# EAGLE design STM32G0_Breakout_Board (EAGLE 9.4.2)
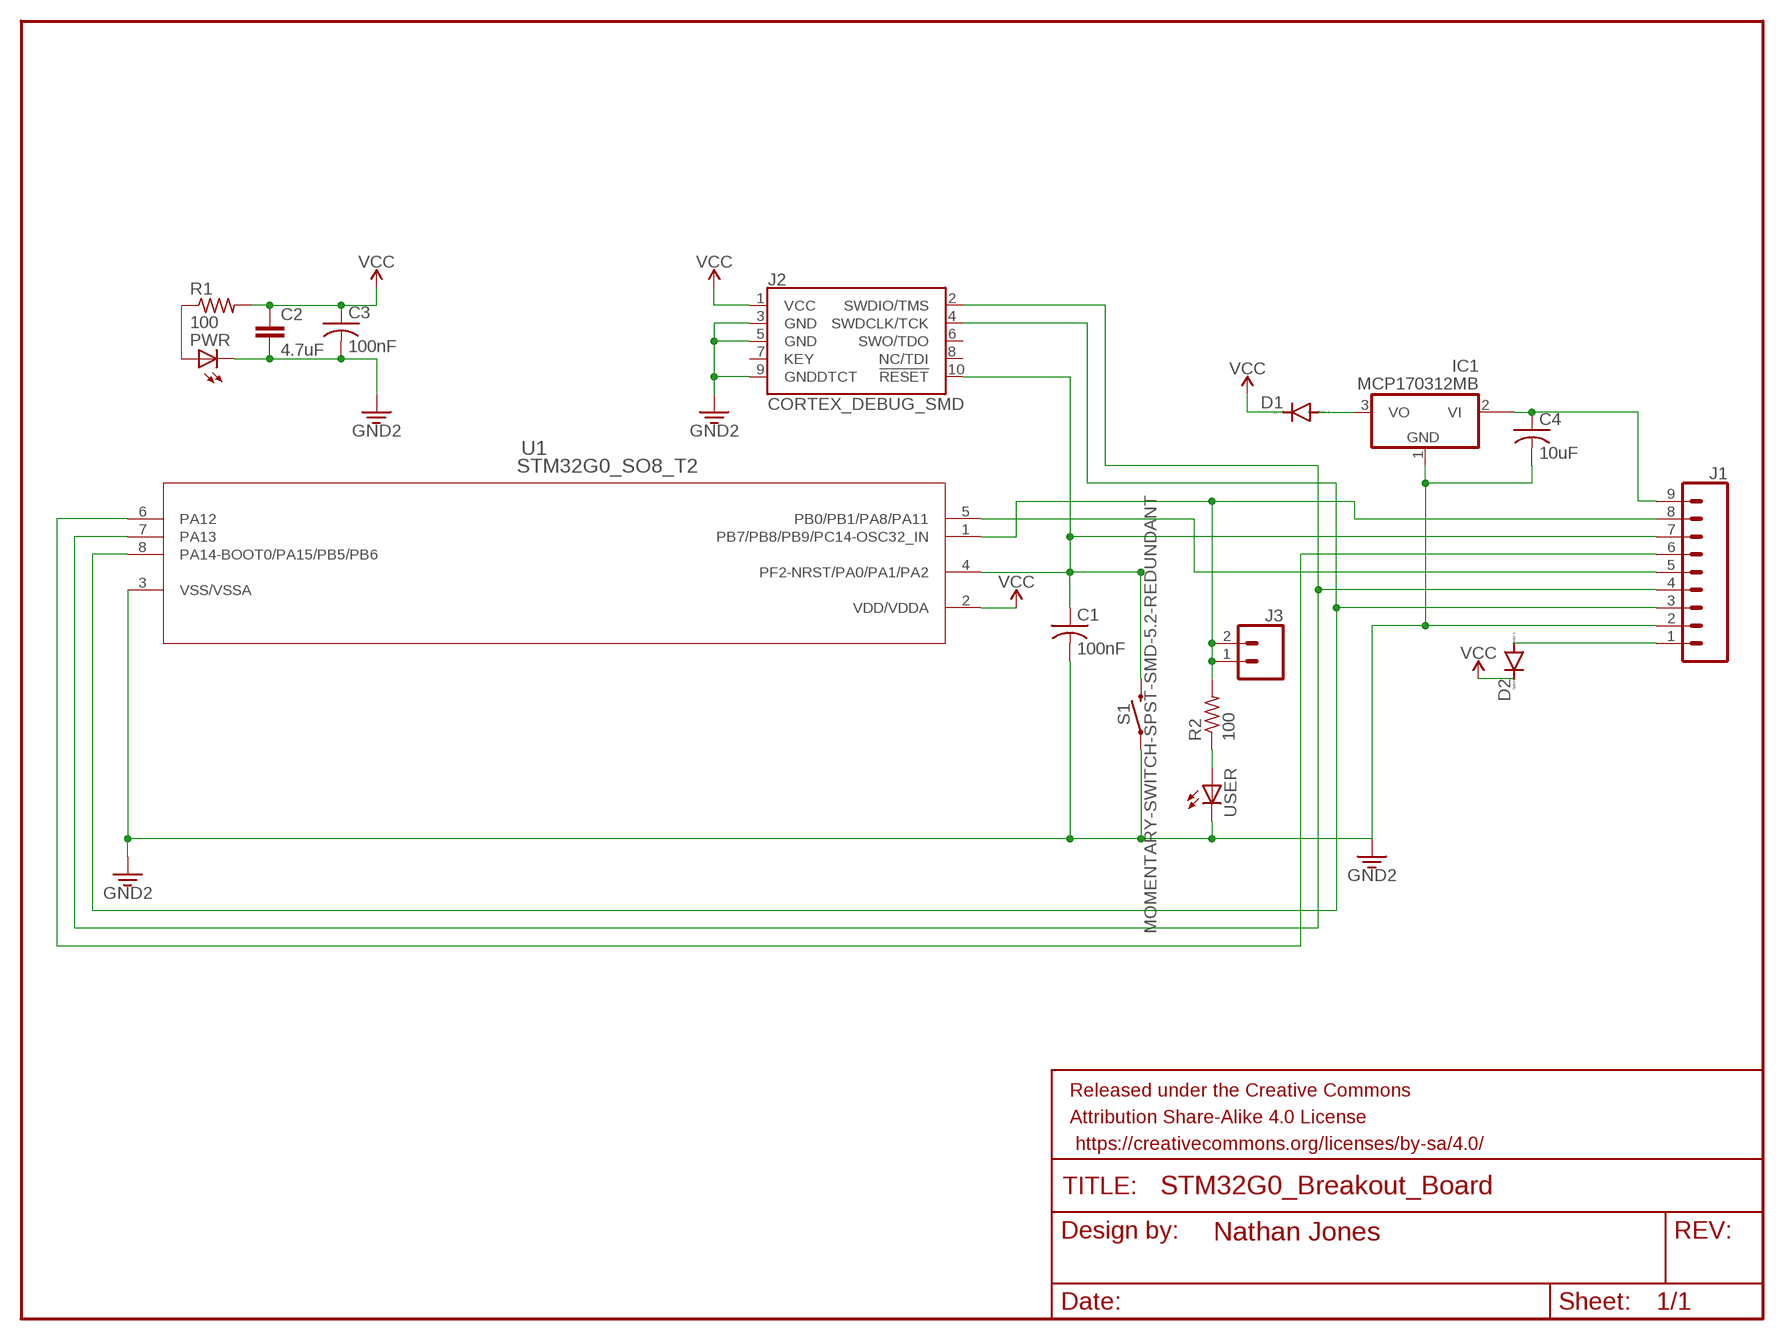
[diagram p0: schematic, sheet 1]

## Parts
C1  100nF  C-USC1206  [C1206]
C2  4.7uF  4.7UF-1206-16V-(+80/-20%)  [1206]
C3  100nF  C-USC1206  [C1206]
C4  10uF  C-USC1206  [C1206]
D1  DIODE-DO-214AC  [DO-214AC]
D2  DIODE-DO-214AC  [DO-214AC]
FRAME1  FRAME-LETTERNO_PACKAGE  [DUMMY]
IC1  MCP170312MB  [SOT89]
J1  CONN_09LONGPADS  [1X09_LONGPADS]
J2  CORTEX_DEBUG_SMD  [SAMTECH_FTSH-105-01]
J3  CONN_02PTH3  [1X02_LONGPADS]
PWR  LEDCHIP-LED0805  [CHIP-LED0805]
R1  100  R-US_R1206  [R1206]
R2  100  R-US_R1206  [R1206]
S1  MOMENTARY-SWITCH-SPST-SMD-5.2-REDUNDANT  [TACTILE_SWITCH_SMD_5.2MM]
U1  STM32G0_SO8_T2  [SO-8]
USER  LEDCHIP-LED0805  [CHIP-LED0805]

## Nets
GND: C1.2 C2.2 C3.2 C4.2 IC1.1(GND) J1.2 J2.3(GND) J2.5(GND) J2.9(GNDDTCT) PWR.C S1.1 S1.2 U1.3(VSS/VSSA) USER.C ; supply symbol labelled GND2
N$1: R2.1 USER.A
N$2: D2.A J1.1
N$3: C4.1 IC1.2@1(VI1) J1.9
N$4: PWR.A R1.1
N$5: D1.A IC1.3(VO)
NRST/PA0/PA1/PA2: C1.1 J1.7 J2.10(!RESET) S1.3 S1.4 U1.4(PF2-NRST/PA0/PA1/PA2)
PA12: J1.6 U1.6(PA12)
PB0/PB1/PA8/PA11: J1.5 U1.5(PB0/PB1/PA8/PA11)
PC14: J1.8 J3.1 J3.2 R2.2 U1.1(PB7/PB8/PB9/PC14-OSC32_IN)
SWDCLK: J1.3 J2.4(SWDCLK/TCK) U1.8(PA14-BOOT0/PA15/PB5/PB6)
SWDIO: J1.4 J2.2(SWDIO/TMS) U1.7(PA13)
VCC: C2.1 C3.1 D1.C D2.C J2.1(VCC) R1.2 U1.2(VDD/VDDA)
Unconnected: IC1.2(VI) J2.6(SWO/TDO) J2.7(KEY) J2.8(NC/TDI)

## Library data of the parts
C1 C3 C4 = adafruit:C-US: CAPACITOR, American symbol
C2 = SparkFun-Capacitors:4.7UF: 4.7µF ceramic capacitors A capacitor is a passive two-terminal electrical component used to store electrical energy temporarily in an electric field.; PROD_ID: CAP-10300
D1 D2 = diode:DIODE-: DIODE
FRAME1 = SparkFun-Aesthetics:FRAME-LETTER: Schematic Frame - Letter Standard 8.5x11 US Letter frame; DESIGNER: Nathan Jones; VERSION: v01
IC1 = linear:MCP1703*: 250 mA, 16V, Low Quiescent Current LDO Regulator Source: http://ww1.microchip.com/downloads/en/DeviceDoc/22049b.pdf
J1 = SparkFun-Connectors:CONN_09: Multi connection point. Often used as Generic Header-pin footprint for 0.1 inch spaced/style header connections On any of the 0.1 inch spaced packages, you can populate with these: Break Away Headers - Straight <https://www.sparkfun.com/products/116> (PRT-00116) Break Away Male Headers - Right Angle <https://www.sparkfun.com/products/553> (PRT-00553) Female Headers <https://www.sparkfun.com/products/115> (PRT-00115) Break Away Headers - Machine Pin <https://www.sparkfun.com/products/117> (PRT-00117) Break Away Female Headers - Swiss Machine Pin <https://www.sparkfun.com/products/743> (PRT-00743) For SCREWTERMINALS and SPRING TERMINALS visit here: Screw Terimnals on SparkFun.com <https://www.sparkfun.com/search/results?term=Screw+Terminals> (5mm/3.5mm/2.54mm spacing) This device is also useful as a general connection point to wire up your design to another part of your project. Our various solder wires solder well into these plated through hole pads. Hook-Up Wire - Assortment (Stranded, 22 AWG) <https://www.sparkfun.com/products/11375> (PRT-11375) Hook-Up Wire - Assortment (Solid Core, 22 AWG) <https://www.sparkfun.com/products/11367> (PRT-11367) View the entire wire category on our website here <https://www.sparkfun.com/categories/141> Special notes: Molex polarized connector foot print use with SKU : PRT-08231 with associated crimp pins and housings. 1MM SMD Version SKU: PRT-10208 NOTES ON THE VARIANTS LOCK and LOCK_LONGPADS... This footprint was designed to help hold the alignment of a through-hole component (i.e. 6-pin header) while soldering it into place. You may notice that each hole has been shifted either up or down by 0.005 of an inch from it's more standard position (which is a perfectly straight line). This slight alteration caused the pins (the squares in the middle) to touch the edges of the holes. Because they are alternating, it causes a "brace" to hold the component in place. 0.005 has proven to be the perfect amount of "off-center" position when using our standard breakaway headers. Although looks a little odd when you look at the bare footprint, once you have a header in there, the alteration is very hard to notice. Also,if you push a header all the way into place, it is covered up entirely on the bottom side.
J2 = SparkFun-Connectors:CORTEX_DEBUG: Cortex Debug Connector - 10 pin Supports JTAG debug, Serial Wire debug, and Serial Wire Viewer. PTH and SMD connector options available. General Connector Information <http://infocenter.arm.com/help/topic/com.arm.doc.faqs/attached/13634/cortex_debug_connectors.pdf> Products: PTH Connector <http://www.digikey.com/product-detail/en/cnc-tech/3220-10-0100-00/1175-1627-ND/3883661> -via Digi-Key SparkFun PSoc <https://www.sparkfun.com/products/13229> SparkFun T <https://www.sparkfun.com/products/13810>
J3 = SparkFun-Connectors:CONN_02: Multi connection point. Often used as Generic Header-pin footprint for 0.1 inch spaced/style header connections On any of the 0.1 inch spaced packages, you can populate with these: Break Away Headers - Straight <https://www.sparkfun.com/products/116> (PRT-00116) Break Away Male Headers - Right Angle <https://www.sparkfun.com/products/553> (PRT-00553) Female Headers <https://www.sparkfun.com/products/115> (PRT-00115) Break Away Headers - Machine Pin <https://www.sparkfun.com/products/117> (PRT-00117) Break Away Female Headers - Swiss Machine Pin <https://www.sparkfun.com/products/743> (PRT-00743) For SCREWTERMINALS and SPRING TERMINALS visit here: Screw Terimnals on SparkFun.com <https://www.sparkfun.com/search/results?term=Screw+Terminals> (5mm/3.5mm/2.54mm spacing) This device is also useful as a general connection point to wire up your design to another part of your project. Our various solder wires solder well into these plated through hole pads. Hook-Up Wire - Assortment (Stranded, 22 AWG) <https://www.sparkfun.com/products/11375> (PRT-11375) Hook-Up Wire - Assortment (Solid Core, 22 AWG) <https://www.sparkfun.com/products/11367> (PRT-11367) View the entire wire category on our website here <https://www.sparkfun.com/categories/141> Special notes: Molex polarized connector foot print use with: PRT-08233 with associated crimp pins and housings. 2.54_SCREWTERM for use with PRT-10571. 3.5mm Screw Terminal footprints for PRT-08084 5mm Screw Terminal footprints for use with PRT-08432
PWR USER = adafruit:LED: LED OSRAM: - CHIPLED LG R971, LG N971, LY N971, LG Q971, LY Q971, LO R971, LY R971 LH N974, LH R974 LS Q976, LO Q976, LY Q976 LO Q996 - Hyper CHIPLED LW Q18S LB Q993, LB Q99A, LB R99A - SideLED LS A670, LO A670, LY A670, LG A670, LP A670 LB A673, LV A673, LT A673, LW A673 LH A674 LY A675 LS A676, LA A676, LO A676, LY A676, LW A676 LS A679, LY A679, LG A679 - Hyper Micro SIDELED® LS Y876, LA Y876, LO Y876, LY Y876 LT Y87S - SmartLED LW L88C, LW L88S LB L89C, LB L89S, LG L890 LS L89K, LO L89K, LY L89K LS L896, LA L896, LO L896, LY L896 - TOPLED LS T670, LO T670, LY T670, LG T670, LP T670 LSG T670, LSP T670, LSY T670, LOP T670, LYG T670 LG T671, LOG T671, LSG T671 LB T673, LV T673, LT T673, LW T673 LH T674 LS T676, LA T676, LO T676, LY T676, LB T676, LH T676, LSB T676, LW T676 LB T67C, LV T67C, LT T67C, LS T67K, LO T67K, LY T67K, LW E67C LS E67B, LA E67B, LO E67B, LY E67B, LB E67C, LV E67C, LT E67C LW T67C LS T679, LY T679, LG T679 LS T770, LO T770, LY T770, LG T770, LP T770 LB T773, LV T773, LT T773, LW T773 LH T774 LS E675, LA E675, LY E675, LS T675 LS T776, LA T776, LO T776, LY T776, LB T776 LHGB T686 LT T68C, LB T68C - Hyper Mini TOPLED® LB M676 - Mini TOPLED Santana® LG M470 LS M47K, LO M47K, LY M47K Source: http://www.osram.convergy.de/
R1 R2 = rcl:R-US_: RESISTOR, American symbol; SPICEPREFIX: R
S1 = SparkFun-Switches:MOMENTARY-SWITCH-SPST: Momentary Switch (Pushbutton) - SPST Normally-open (NO) SPST momentary switches (buttons, pushbuttons). Variants PTH-12MM - 12mm square, through-hole Momentary Pushbutton Switch - 12mm Square <https://www.sparkfun.com/products/9190> (COM-09190) PTH-6.0MM, PTH-6.0MM-KIT - 6.0mm square, through-hole Mini Pushbutton Switch <https://www.sparkfun.com/products/97> (COM-00097) KIT package intended for soldering kit's - only one side of pads' copper is exposed. PTH-RIGHT-ANGLE-KIT - Right-angle, through-hole Right Angle Tactile Button <https://www.sparkfun.com/products/10791> - Used on SparkFun BigTime Watch Kit <https://www.sparkfun.com/products/11734> SMD-12MM - 12mm square, surface-mount Tactile Button - SMD (12mm) <https://www.sparkfun.com/products/12993> (COM-12993) Used on SparkFun PicoBoard <https://www.sparkfun.com/products/11888> SMD-4.5MM - 4.5mm Square Trackball Switch Used on SparkFun Blackberry Trackballer Breakout <https://www.sparkfun.com/products/13169> SMD-4.6MMX2.8MM - 4.60mm x 2.80mm, surface mount Used on SparkFun SAMD21 Mini Breakout <https://www.sparkfun.com/products/13664> SMD-5.2MM, SMD-5.2-REDUNDANT - 5.2mm square, surface-mount Mini Pushbutton Switch - SMD <https://www.sparkfun.com/products/8720> (COM-08720) Used on Arduino Pro Mini <https://www.sparkfun.com/products/11114> REDUNDANT package connects both switch circuits together SMD-6.0X3.5MM - 6.0 x 3.5mm, surface mount Momentary Reset Switch SMD <https://www.sparkfun.com/products/8229> (COM-08229) SMD-6.2MM-TALL - 6.2mm square, surface mount Tactile Button - SMD (6mm) <https://www.sparkfun.com/products/12992> Used on SparkFun Digital Sandbox <https://www.sparkfun.com/products/12651> SMD-RIGHT-ANGLE - Right-angle, surface mount Used on SparkFun Block for Intel® Edison - Arduino <https://www.sparkfun.com/products/13036>; PROD_ID: SWCH-08247; SF_SKU: COM-08720
U1 = STM32G0:STM32G0_SO8_T2; MANUFACTURER_PART_NUMBER: STM32G0_SO8_T2; VENDOR: STMicroelectronics

## Board
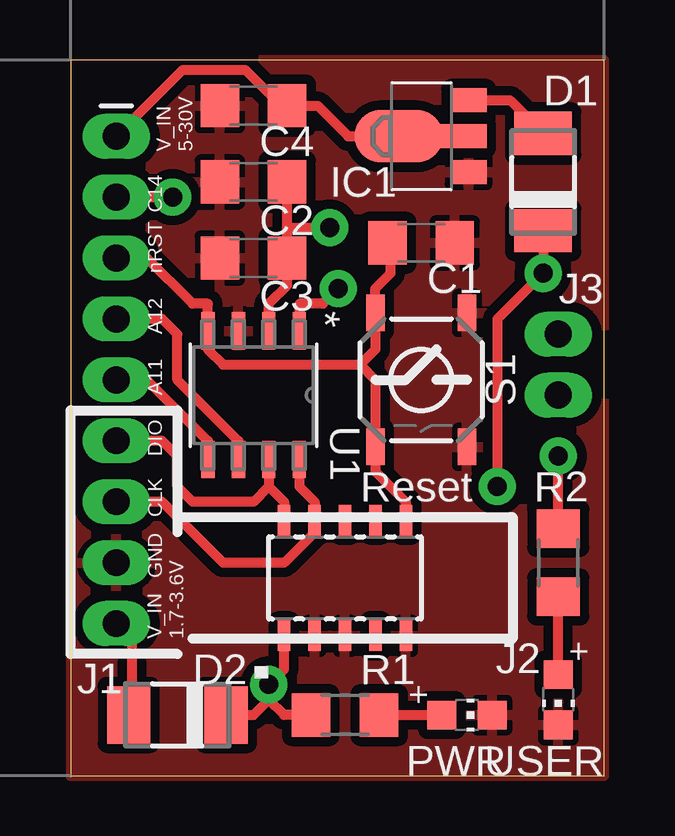
[diagram p1: board, top side]
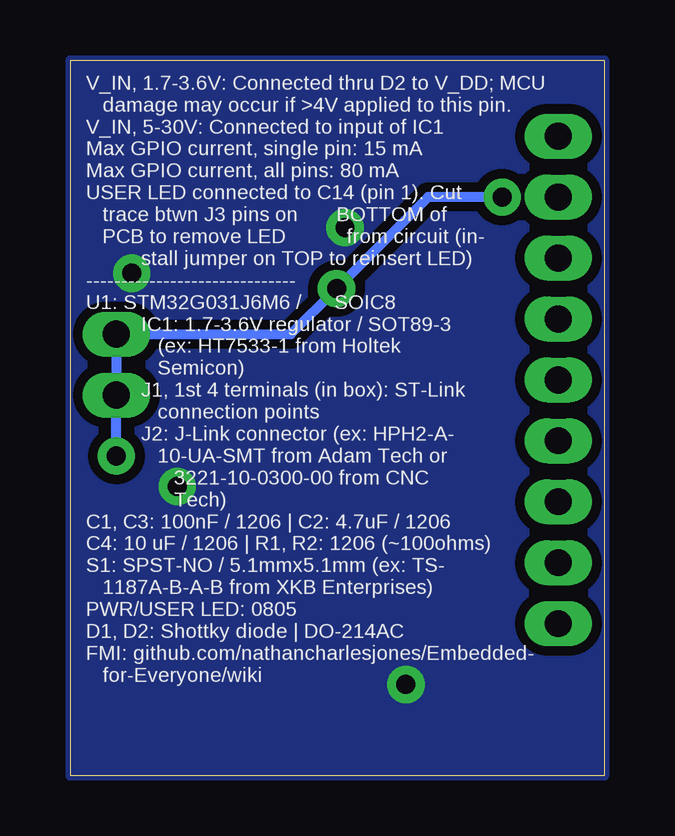
[diagram p2: board, bottom side, seen from below]

Size 22.23 x 29.84 mm. Coordinates in mm from the lower left corner, seen from the top.
Outline: 0,0 22.23,0 22.23,29.84 0,29.84 0,0
Copper layers (1*16): Top 0.035mm / dielectric 1.5mm / Bottom 0.035mm
Design rules "OthermillDRC_1_64_v2": minimum track width 16mil, minimum drill 31mil, track to track 0.39878125mm, track to pad 0.39878125mm, pad to pad 0.39878125mm, via to via 0.39878125mm, smd to smd 0mil, copper to edge 0mil, drill to drill 1mil, minimum pad ring 0mil, minimum via ring 15mil, stop-mask expansion 1mil, vias tented up to drill 30mil, thermal gap 10mil
tKeepout: area 18.4,14.6 to 22.2,19.7
bKeepout: area 0,5.1 to 3.8,27.9

### Footprints (pad centres in the part's own frame; a part is rotated, then mirrored left to right if it is on the bottom)
C1206 = smd 1.6 x 1.8: 1 -1.4,0; 2 1.4,0
1206 = smd 1.6 x 1.8: 1 -1.4,0; 2 1.4,0
DO-214AC = smd 1.8 x 2.4: A 2.025,0; C -2.025,0
SOT89 = smd 1 x 1.5: 1 -1.499,-1.981; 3 1.499,-1.981 | smd 1 x 2: 2 0,-1.727 | smd 2.2 x 3.7: 2@1 0,0.94
1X09_LONGPADS = drill 1.118 pad 1.88 long: 1 0,0; 2 2.54,0; 3 5.08,0; 4 7.62,0; 5 10.16,0; 6 12.7,0; 7 15.24,0; 8 17.78,0; 9 20.32,0
SAMTECH_FTSH-105-01 = smd 0.508 x 1.27: 1 -2.54,-2.413; 2 -2.54,2.413; 3 -1.27,-2.413; 4 -1.27,2.413; 5 0,-2.413; 6 0,2.413; 7 1.27,-2.413; 8 1.27,2.413; 9 2.54,-2.413; 10 2.54,2.413
1X02_LONGPADS = drill 1.118 pad 1.88 long: 1 0,0; 2 2.54,0
CHIP-LED0805 = smd 1.2 x 1.2: A 0,-1.05; C 0,1.05
R1206 = smd 1.6 x 1.803: 1 -1.422,0; 2 1.422,0
TACTILE_SWITCH_SMD_5.2MM = smd 1.524 x 0.762: 1 -2.794,1.905; 2 2.794,1.905; 3 -2.794,-1.905; 4 2.794,-1.905
SO-8 = smd 1.549 x 0.559: 1 -2.68,1.905; 2 -2.68,0.635; 3 -2.68,-0.635; 4 -2.68,-1.905; 5 2.68,-1.905; 6 2.68,-0.635; 7 2.68,0.635; 8 2.68,1.905

### Placement (x,y rotation side)
C1  14.61,22.23 0 top
C2  7.62,24.77 180 top
C3  7.62,21.59 180 top
C4  7.62,27.94 180 top
D1  19.68,24.77 90 top
D2  4.45,2.54 180 top
FRAME1  0,6.35 0 top
IC1  14.61,26.67 90 top
J1  1.91,6.35 90 top
J2  11.43,8.26 0 top
J3  20.32,15.88 90 top
PWR  16.51,2.54 270 top
R1  11.43,2.54 180 top
R2  20.32,8.89 90 top
S1  14.61,16.51 270 top
U1  7.62,15.88 270 top
USER  20.32,3.17 180 top

### Tracks (layer width: path | path; a pad name or v marks a point on that pad's centre or on a via)
GND
  pour Top: 0,0 22.23,0 22.23,29.84 0,29.84
N$1
  Top 0.406: USER.A R2.1
N$2
  Top 0.406: J1.1 2.54,5.71 2.54,2.66 D2.A
N$3
  Top 0.406: J1.9 4.68,29.44 7.27,29.44 8.77,27.94 C4.1 10.29,27.94 11.56,26.67 IC1.2@1
N$4
  Top 0.406: R1.1 PWR.A
N$5
  Top 0.406: IC1.3 18.31,28.17 D1.A
NRST/PA0/PA1/PA2
  Top 0.406: J1.7 3.17,21.59 5.08,19.68 5.71,19.68 U1.4 5.71,17.78 6.35,17.14 12.06,17.14 | 12.06,17.14 12.7,16.51 S1.4 12.7,12.7 13.97,11.43 J2.10 | 12.06,17.14 12.7,17.78 S1.3 12.7,20.32 13.34,20.95 13.34,22.09 C1.1
PA12
  Top 0.406: U1.6 6.99,13.97 4.45,16.51 4.45,18.41 3.81,19.05 J1.6
PB0/PB1/PA8/PA11
  Top 0.406: U1.5 5.71,13.97 3.17,16.51 J1.5
PC14  (via drill 0.79)
  Top 0.406: R2.2 v20.32,13.34 | v11.15,20.32 10.51,19.68 9.53,19.68 U1.1 | J1.8 v4.25,24.13
  Bottom 0.406: v20.32,13.34 J3.1 J3.2 13.05,18.41 v11.15,20.32 7.34,24.13 v4.25,24.13
SWDCLK
  Top 0.406: U1.8 9.53,12.06 10.16,11.43 J2.4 10.16,10.16 8.89,8.89 6.35,8.89 3.81,11.43 J1.3
SWDIO
  Top 0.406: U1.7 8.26,12.06 | 8.26,12.06 8.89,11.43 J2.2 | 8.26,12.06 7.62,11.43 5.08,11.43 4.45,12.06 4.45,13.34 3.81,13.97 J1.4
VCC  (via drill 0.79)
  Top 0.406: D2.C 7.62,2.54 8.26,3.17 | 8.26,3.17 v8.26,3.81 8.89,4.45 J2.1 | R1.2 8.89,2.54 8.26,3.17 | D1.C v19.68,20.95 17.78,19.05 v17.78,12.06 | U1.2 8.26,19.68 9.02,20.45 C3.1 9.02,22.86 | 9.02,22.86 C2.1 | 9.02,22.86 v10.79,22.86
  pour Bottom: 0,0 22.23,0 22.23,29.84 0,29.84

### Text on the board
tNames: V_IN / 5-30V | C14 | nRST | A12 | A11 | DIO | CLK | Reset | GND | V_IN / 1.7-3.6V | .
bNames: V_IN, 1.7-3.6V: Connected thru D2 to V_DD; MCU / damage may occur if >4V applied to this pin. / V_IN, 5-30V: Connected to input of IC1 / Max GPIO current, single pin: 15 mA / Max GPIO current, all pins: 80 mA / USER LED connected to C14 (pin 1). Cut / trace btwn J3 pins on BOTTOM of / PCB to remove LED from circuit (in- / stall jumper on TOP to reinsert LED) / ------------------------------ / U1: STM32G031J6M6 / SOIC8 / IC1: 1.7-3.6V regulator / SOT89-3 / (ex: HT7533-1 from Holtek / Semicon) / J1, 1st 4 terminals (in box): ST-Link / connection points / J2: J-Link connector (ex: HPH2-A- / 10-UA-SMT from Adam Tech or / 3221-10-0300-00 from CNC / Tech) / C1, C3: 100nF / 1206 | C2: 4.7uF / 1206 / C4: 10 uF / 1206 | R1, R2: 1206 (~100ohms) / S1: SPST-NO / 5.1mmx5.1mm (ex: TS- / 1187A-B-A-B from XKB Enterprises) / PWR/USER LED: 0805 / D1, D2: Shottky diode | DO-214AC / FMI: github.com/nathancharlesjones/Embedded- / for-Everyone/wiki